# EAGLE design Tic Tac PIC_628(e) (EAGLE 5.11)
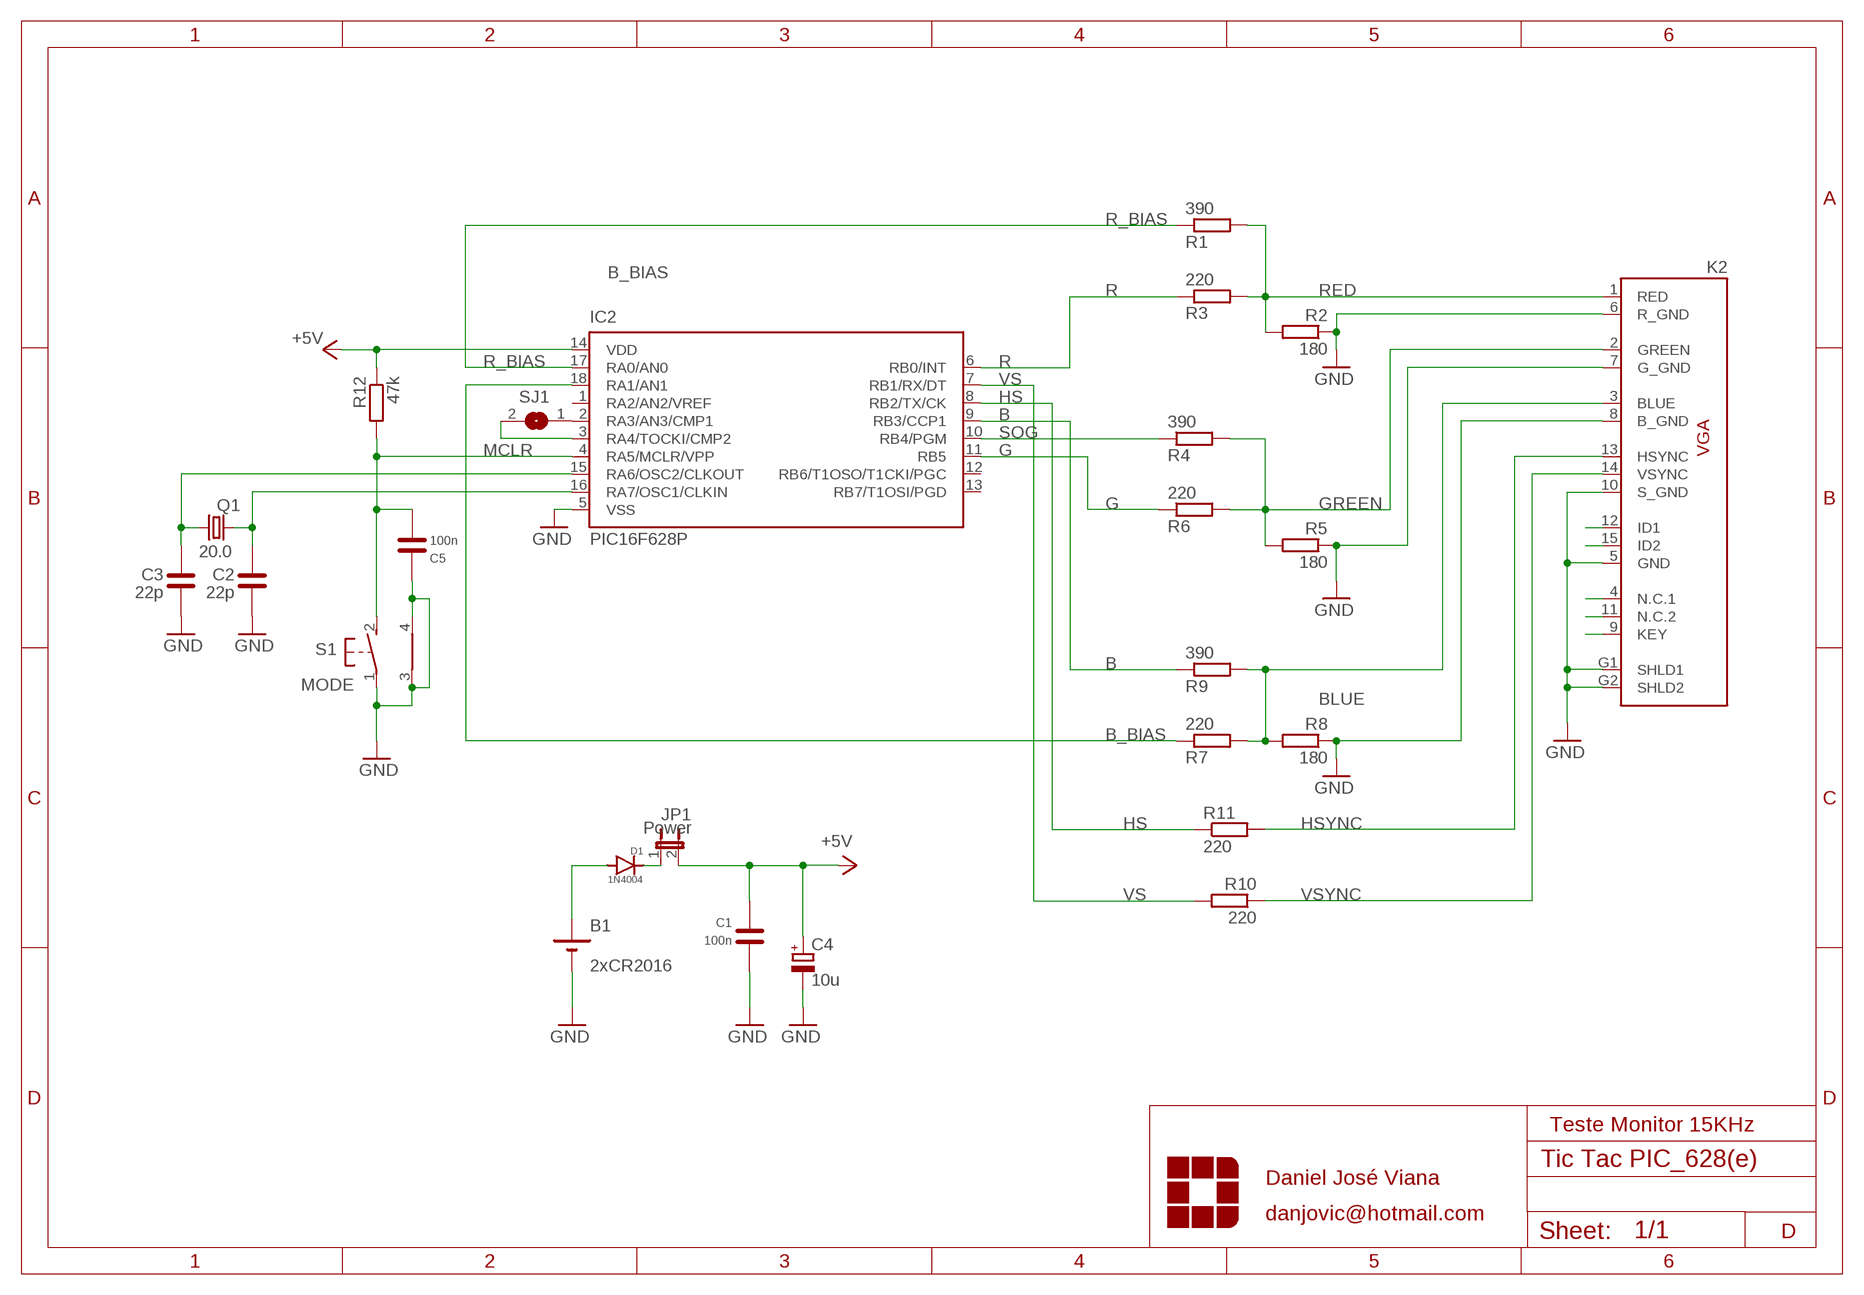
[diagram p0: schematic, sheet 1]

## Parts
B1  2xCR2016  CR2032H1GJ00245  [CR2032-1GJ00245]
C1  100n  CCERAMICO  [C050-024X044]
C2  22p  C  [C025-024X044]
C3  22p  C  [C025-024X044]
C4  10u  CPOL-EUE2-4_LARGEPADS  [E2-4_LARGEPADS]
C5  100n  C  [C025-024X044]
D1  1N4004  D200  [D200]
IC2  PIC16F628P  [DIL18]
JP1  Power  JP1E  [JP1]
K2  CON_VGA_SH-  [HDF15H]
Q1  20.0  CRYSTALHC49S  [HC49/S]
R1  390  R-EU_0204/5A  [0204/5A]
R2  180  R-EU_0204/5A  [0204/5A]
R3  220  R-EU_0204/5A  [0204/5A]
R4  390  R-EU_0204/5A  [0204/5A]
R5  180  R-EU_0204/5A  [0204/5A]
R6  220  R-EU_0204/5A  [0204/5A]
R7  220  R-EU_0204/5A  [0204/5A]
R8  180  R-EU_0204/5A  [0204/5A]
R9  390  R-EU_0204/5A  [0204/5A]
R10  220  R-EU_0204/5A  [0204/5A]
R11  220  R-EU_0204/5A  [0204/5A]
R12  47k  R-EU_0204/5A  [0204/5A]
S1  MODE  31-XX  [B3F-31XX]
SJ1  SJ  [SJ]

## Nets
+5V: C1.2 C4.+ IC2.14(VDD) JP1.2 R12.1
B: IC2.9(RB3/CCP1) R9.1
B_BIAS: IC2.18(RA1/AN1) R7.1
BLUE: K2.3(BLUE) R7.2 R8.2 R9.2
G: IC2.11(RB5) R6.1
GND: B1.MINUS C1.1 C2.1 C3.1 C4.- C5.2 IC2.5(VSS) K2.5(GND) K2.6(R_GND) K2.7(G_GND) K2.8(B_GND) K2.10(S_GND) K2.G1(SHLD1) K2.G2(SHLD2) R2.1 R5.1 R8.1 S1.1(P) S1.3(SH1) S1.4(SH2)
GREEN: K2.2(GREEN) R4.2 R5.2 R6.2
HS: IC2.8(RB2/TX/CK) R11.1
HSYNC: K2.13(HSYNC) R11.2
MCLR: C5.1 IC2.4(RA5/MCLR/VPP) R12.2 S1.2(S)
N$1: IC2.3(RA4/TOCKI/CMP2) SJ1.2
N$2: K2.9(KEY)
N$3: D1.K JP1.1
N$4: K2.12(ID1)
N$5: K2.15(ID2)
N$6: K2.4(N.C.1)
N$7: K2.11(N.C.2)
N$8: IC2.2(RA3/AN3/CMP1) SJ1.1
R: IC2.6(RB0/INT) R3.1
R_BIAS: IC2.17(RA0/AN0) R1.1
RED: K2.1(RED) R1.2 R2.2 R3.2
SOG: IC2.10(RB4/PGM) R4.1
VBAT: B1.PLUS D1.A
VS: IC2.7(RB1/RX/DT) R10.2
VSYNC: K2.14(VSYNC) R10.1
X1: C3.2 IC2.15(RA6/OSC2/CLKOUT) Q1.1
X2: C2.2 IC2.16(RA7/OSC1/CLKIN) Q1.2
Unconnected: IC2.1(RA2/AN2/VREF) IC2.12(RB6/T1OSO/T1CKI/PGC) IC2.13(RB7/T1OSI/PGD)

## Notes on the sheet
- Teste Monitor 15KHz
- Daniel José Viana
- danjovic@hotmail.com
- D

## Library data of the parts
B1 = diversos2:CR2032H: LI BATTERY Varta
C1-C3 C5 = diversos2:C*
C4 = rcl:CPOL-EU: POLARIZED CAPACITOR, European symbol
D1 = diversos2:D*: Diodo
IC2 = microchip:PIC16F62*: FLASH-Based 8-Bit CMOS Microcontroller Source: http://ww1.microchip.com/downloads/en/DeviceDoc/40300C.pdf; MF: MICROCHIP; MPN: PIC16F628-04I/P; OC_FARNELL: 9760407; OC_NEWARK: 19C7272
JP1 = jumper:JP1E: JUMPER
K2 = diversos2:CON_VGA_SH-: SUB D, 15 positions, high density
Q1 = diversos2:CRYSTAL: CRYSTAL; OC_FARNELL: 1667008; OC_NEWARK: unknown
R1-R12 = rcl:R-EU_: RESISTOR, European symbol
S1 = diversos2:31-XX: OMRON SWITCH; MPN: B3F-3100; OC_FARNELL: 959704; OC_NEWARK: 36M3582
SJ1 = jumper:SJ: SMD solder JUMPER

## Board
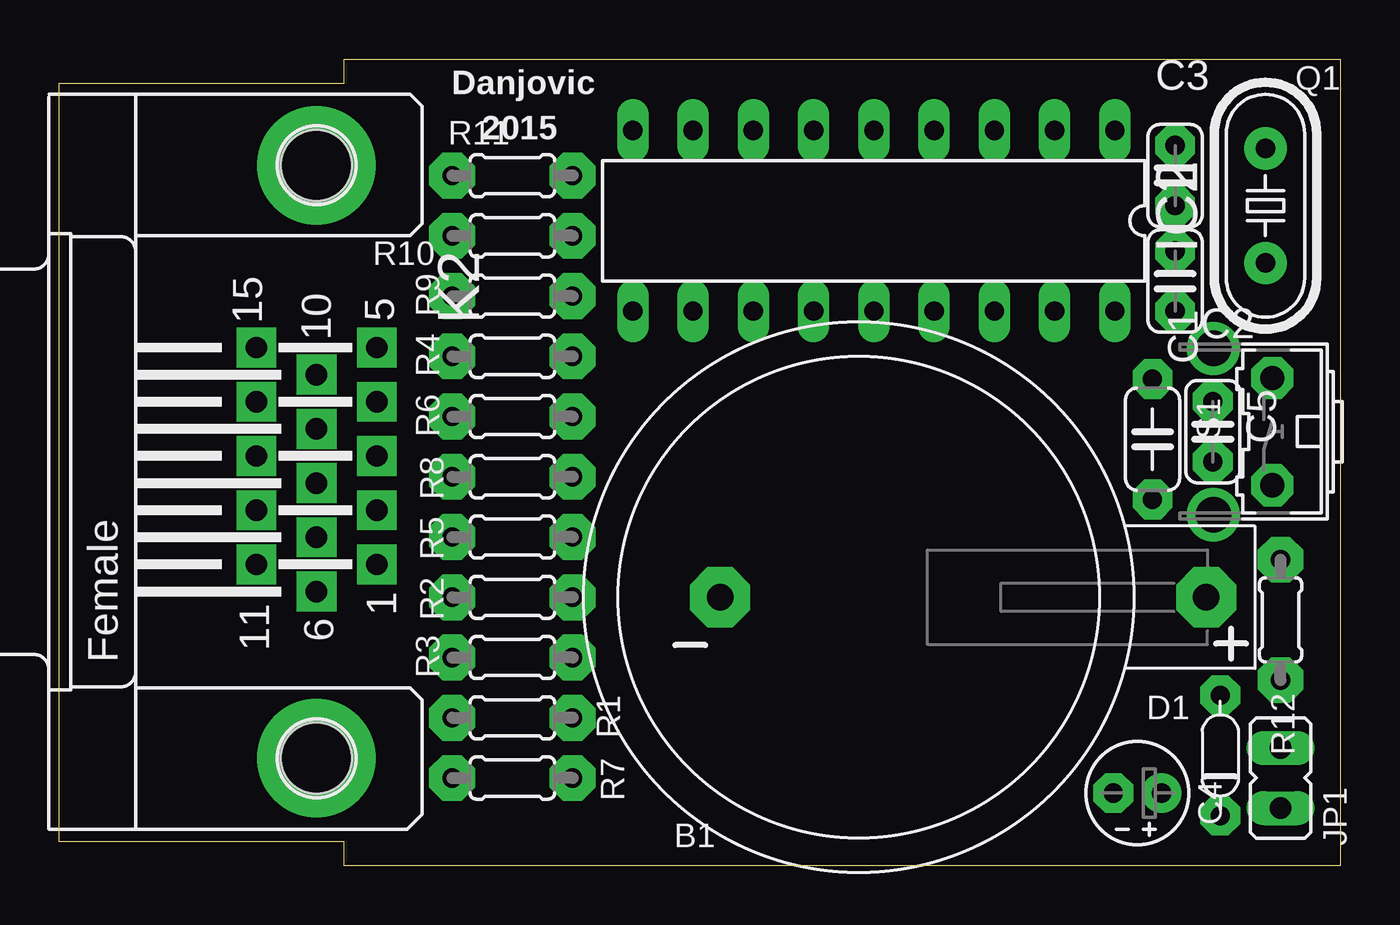
[diagram p1: board, top side]
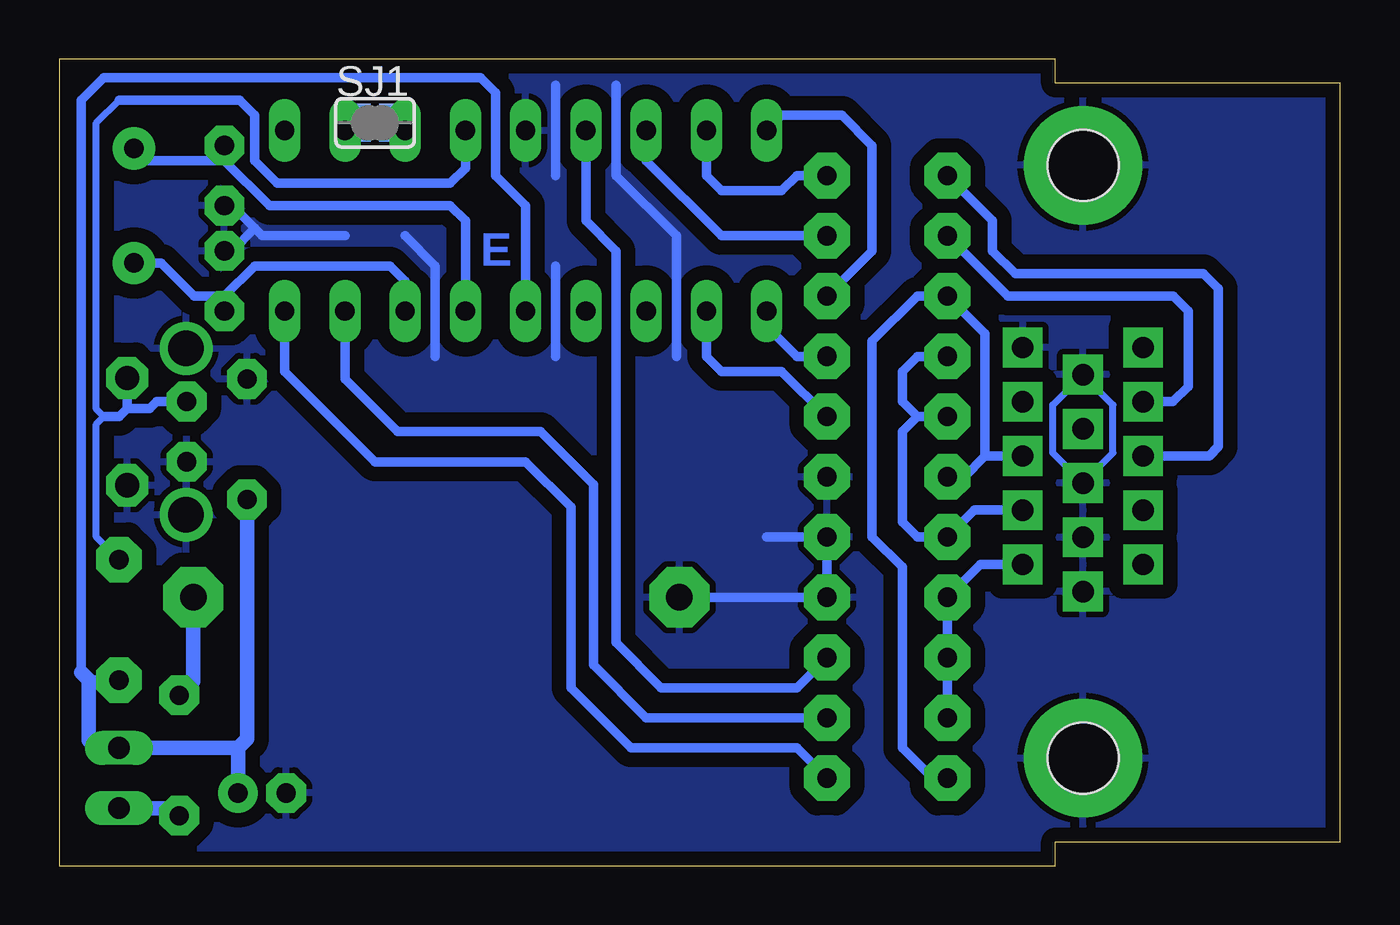
[diagram p2: board, bottom side, seen from below]

Size 54 x 34 mm. Coordinates in mm from the lower left corner, seen from the top.
Copper layers (1*16): Top 0.035mm / dielectric 1.5mm / Bottom 0.035mm
Design rules "default *": minimum track width 10mil, minimum drill 24mil, track to track 8mil, track to pad 8mil, pad to pad 8mil, via to via 8mil, smd to smd 8mil, copper to edge 20mil, drill to drill 8mil, minimum pad ring 10mil, minimum via ring 8mil, stop-mask expansion 4mil, vias tented up to drill 0mil, thermal gap 10mil

### Footprints (pad centres in the part's own frame; a part is rotated, then mirrored left to right if it is on the bottom)
CR2032-1GJ00245 = drill 1.118 pad 2.54 octagon: MINUS 5.85,0; PLUS -14.65,0
C050-024X044 = drill 0.8 pad 1.676 octagon: 1 -2.54,0; 2 2.54,0
C025-024X044 = drill 0.813 pad 1.676 octagon: 1 -1.27,0; 2 1.27,0
E2-4_LARGEPADS = drill 0.813 pad 1.676 round: + -1.016,0 | drill 0.813 pad 1.676 octagon: - 1.016,0
D200 = drill 0.8 pad 1.676 octagon: A -2.54,0; K 2.54,0
DIL18 = drill 0.813 long: 1 -10.16,-3.81; 2 -7.62,-3.81; 3 -5.08,-3.81; 4 -2.54,-3.81; 5 0,-3.81; 6 2.54,-3.81; 7 5.08,-3.81; 8 7.62,-3.81; 9 10.16,-3.81; 10 10.16,3.81; 11 7.62,3.81; 12 5.08,3.81; 13 2.54,3.81; 14 0,3.81; 15 -2.54,3.81; 16 -5.08,3.81; 17 -7.62,3.81; 18 -10.16,3.81
JP1 = drill 0.914 long: 1 0,-1.27; 2 0,1.27
HDF15H = drill 0.9 pad 1.676 square: 1 4.329,2.54; 2 2.043,2.54; 3 -0.243,2.54; 4 -2.529,2.54; 5 -4.815,2.54; 6 5.472,0; 7 3.186,0; 8 0.9,0; 9 -1.386,0; 10 -3.672,0; 11 4.329,-2.54; 12 2.043,-2.54; 13 -0.243,-2.54; 14 -2.529,-2.54; 15 -4.815,-2.54 | drill 3 pad 5 round: G1 -12.5,0; G2 12.5,0 | hole 3: -12.5,0; 12.5,0
HC49/S = drill 0.813 pad 1.778 round: 1 -2.413,0; 2 2.413,0
0204/5A = drill 0.813 pad 1.93 octagon: 1 -2.54,0; 2 2.54,0
B3F-31XX = drill 1.016 pad 1.778 octagon: 1 -2.261,-1.245; 2 2.261,-1.245 | drill 1.499 pad 2.159 round: 3 -3.505,1.245; 4 3.505,1.245
SJ = smd 1.168 x 1.6: 1 -0.762,0; 2 0.762,0

### Placement (x,y rotation side)
B1  33.7,11.31 180 top
C1  46.09,17.98 270 top
C2  47.04,24.65 270 top
C3  47.04,29.09 90 top
C4  45.45,3.06 180 top
C5  48.63,18.3 270 top
D1  48.95,4.65 270 top
IC2  34.34,27.19 180 top
JP1  51.48,3.69 0 top
K2  10.84,17.03 270 top
Q1  50.85,27.82 270 top
R1  19.1,6.23 180 top
R2  19.1,11.31 180 top
R3  19.1,8.77 180 top
R4  19.1,21.47 180 top
R5  19.1,13.85 180 top
R6  19.1,18.93 180 top
R7  19.1,3.69 180 top
R8  19.1,16.39 180 top
R9  19.1,24.02 180 top
R10  19.1,26.55 0 top
R11  19.1,29.09 180 top
R12  51.48,10.36 90 top
S1  49.9,18.3 90 top
SJ1  40.69,31.32 0 bottom
U$1  [TIC_TAC_INSET]  0,17 0 top

### Tracks (layer width: path | path; a pad name or v marks a point on that pad's centre or on a via)
+5V
  Bottom 0.406: IC2.14 34.34,27.82 35.61,29.09 35.61,32.59 36.24,33.22 52.12,33.22 53.07,32.27 53.07,8.14 | 52.76,7.82 R12.1
  Bottom 0.61: 53.07,8.14 52.76,7.82 52.76,5.28 52.44,4.96 JP1.2 46.47,4.96 | C4.+ 46.47,4.96 | C1.2 46.09,5.35 46.47,4.96
B
  Bottom 0.406: R9.1 19.73,25.92 19.73,30.36 21.01,31.63 23.55,31.63 IC2.9
B_BIAS
  Bottom 0.406: R7.1 22.91,4.96 29.89,4.96 32.44,7.5 32.44,15.12 34.34,17.03 40.69,17.03 44.5,20.84 IC2.18
BLUE
  Bottom 0.406: R7.2 17.2,3.69 18.46,4.96 18.46,12.59 19.73,13.85 19.73,20.84 19.73,22.11 17.83,24.02 R9.2 14.97,22.43 14.97,17.27 | 14.97,17.27 K2.3 | R8.2 15.85,16.39 14.97,17.27
G
  Bottom 0.406: R6.1 23.55,20.84 26.09,20.84 26.72,21.47 IC2.11
GND
  Bottom 0.305: K2.8 12.11,17.4 12.11,19.43 K2.10 9.57,19.43 9.57,17.4 K2.8
  Bottom 0.406: B1.MINUS R2.1 R5.1 24.18,13.85 | 33.07,29.09 33.07,32.9 | 27.99,21.47 27.99,26.55 30.53,29.09 30.53,32.9 | 39.42,26.55 38.15,25.28 38.15,21.47 | C3.1 46.72,27.82 45.77,26.87 | 45.77,26.87 45.45,26.55 41.96,26.55 | C2.1 46.72,25.92 45.77,26.87 | 33.07,21.47 33.07,25.28
  pour Bottom (isolate 0.61): -0.59,34.17 -0.59,-0.12 54.02,-0.12 54.02,34.17
GREEN
  Bottom 0.406: K2.2 15.43,14.99 R5.2 17.83,13.85 18.46,14.49 18.46,18.3 17.83,18.93 | R4.2 17.83,21.47 18.46,20.84 18.46,19.57 17.83,18.93 | 17.83,18.93 R6.2
HS
  Bottom 0.406: R11.1 22.91,29.09 23.55,28.46 26.09,28.46 26.72,29.09 IC2.8
HSYNC
  Bottom 0.406: K2.13 5.52,17.27 5.13,17.66 5.13,24.33 5.77,24.97 13.7,24.97 14.65,25.92 14.65,27.19 15.92,28.46 R11.2
MCLR
  Bottom 0.305: 51.48,32.27 52.44,31.32 52.44,19.25 52.12,18.93 52.44,18.62 52.44,13.85 R12.2
  Bottom 0.406: IC2.4 36.88,29.41 37.52,28.78 38.15,28.78 44.82,28.78 45.77,29.73 45.77,31.63 46.41,32.27 51.48,32.27 | 52.12,18.93 51.48,18.93 51.14,19.28 | 51.14,19.28 S1.2 | 51.14,19.28 50.19,19.28 49.9,19.57 C5.1
N$1
  Bottom 0.406: IC2.3 39.61,31 SJ1.2
N$3
  Bottom 0.61: JP1.1 49.26,2.42 D1.K
N$8
  Bottom 0.406: SJ1.1 41.64,31.32 IC2.2
R
  Bottom 0.406: R3.1 22.91,7.5 28.62,7.5 30.53,9.41 30.53,25.92 31.8,27.19 IC2.6
R_BIAS
  Bottom 0.406: R1.1 29.26,6.23 31.48,8.46 31.48,16.08 33.7,18.3 39.74,18.3 41.96,20.52 IC2.17
RED
  Bottom 0.406: K2.1 15.17,12.7 R2.2 R3.2 R1.2
SOG
  Bottom 0.406: R4.1 22.91,21.47 24.18,22.74 IC2.10
TITLE
  pour Bottom: 42.59,1.79 42.59,15.44 34.66,15.44 34.34,15.12 34.34,1.79
VBAT
  Bottom 0.61: B1.PLUS 48.35,7.78 D1.A
VS
  Bottom 0.406: R10.2 26.09,26.55 29.26,29.73 IC2.7
VSYNC
  Bottom 0.406: K2.14 7.05,19.56 6.4,20.2 6.4,23.38 7.04,24.02 14.02,24.02 R10.1
X1
  Bottom 0.406: IC2.15 36.88,25.92 36.88,27.19 37.52,27.82 45.13,27.82 47.04,29.73 | 47.04,29.73 C3.2 | Q1.1 50.34,29.73 47.04,29.73
X2
  Bottom 0.406: IC2.16 39.42,24.65 40.05,25.28 45.77,25.28 47.04,24.02 | 47.04,24.02 48.31,24.02 49.71,25.41 Q1.2 | 47.04,24.02 C2.2

### Text on the board
Bottom: E
tPlace: Danjovic | 2015
bRestrict: 2015 | Danjovic | TicTac X